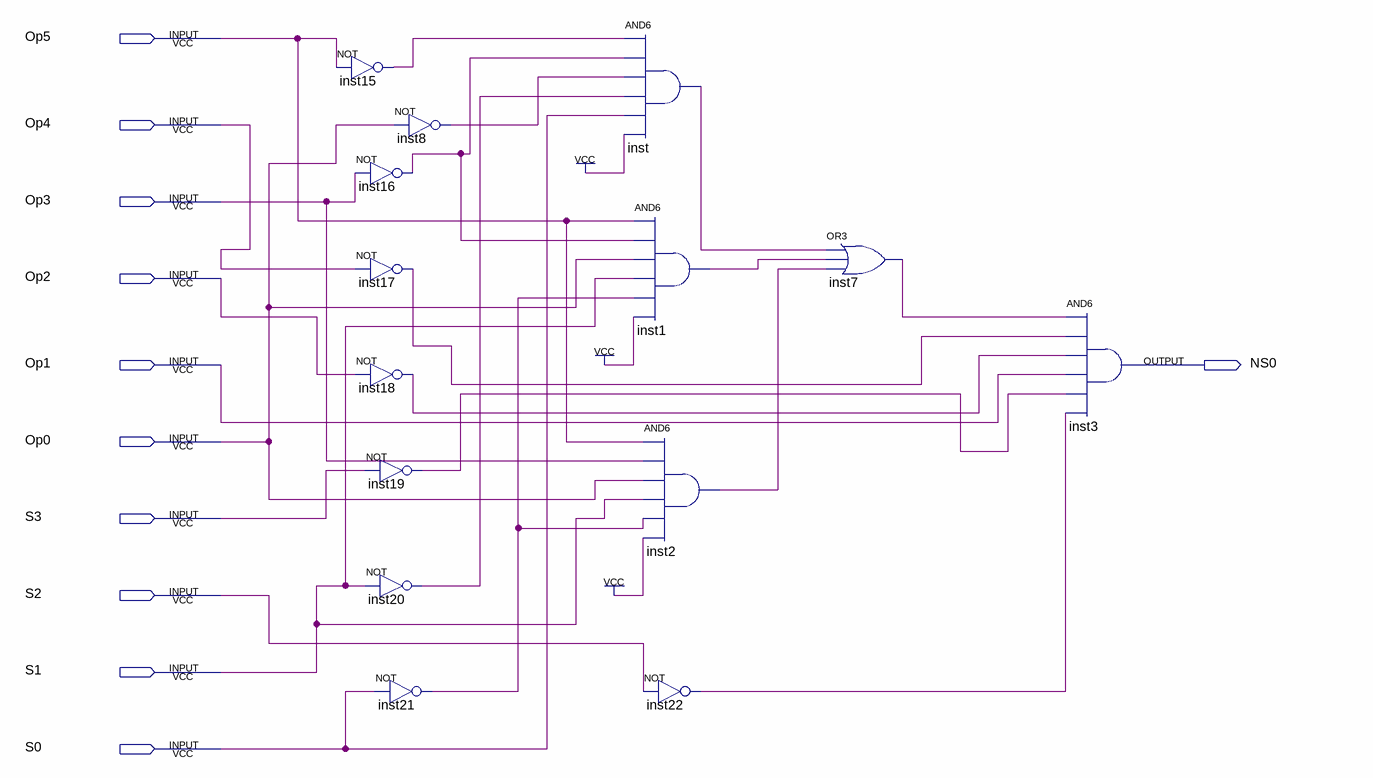
[diagram p0: schematic sheet]
// Quartus schematic NS0.bdf as structural Verilog: 14 symbols, 11 pins
module NS0 (
  input  Op5,
  input  Op4,
  input  Op3,
  input  Op2,
  input  Op1,
  input  Op0,
  input  S3,
  input  S2,
  input  S1,
  input  S0,
  output NS0
);

  wire inst1_out, inst2_out, inst7_out, inst8_out, inst15_out, inst16_out, inst17_out, inst18_out,
       inst19_out, inst20_out, inst21_out, inst22_out, inst_out;

  not inst15 (inst15_out, Op5);
  not inst16 (inst16_out, Op3);
  not inst17 (inst17_out, Op4);
  not inst18 (inst18_out, Op2);
  not inst19 (inst19_out, S3);
  not inst20 (inst20_out, S1);
  not inst21 (inst21_out, S0);
  not inst8 (inst8_out, Op0);
  and inst (inst_out, inst15_out, inst16_out, inst8_out, inst20_out, S0, 1'b1);
  and inst1 (inst1_out, Op5, inst16_out, Op0, S1, inst21_out, 1'b1);
  and inst2 (inst2_out, Op5, Op3, Op0, S1, inst21_out, 1'b1);
  not inst22 (inst22_out, S2);
  or inst7 (inst7_out, inst_out, inst1_out, inst2_out);
  and inst3 (NS0, inst7_out, inst17_out, inst18_out, Op1, inst19_out, inst22_out);
endmodule
